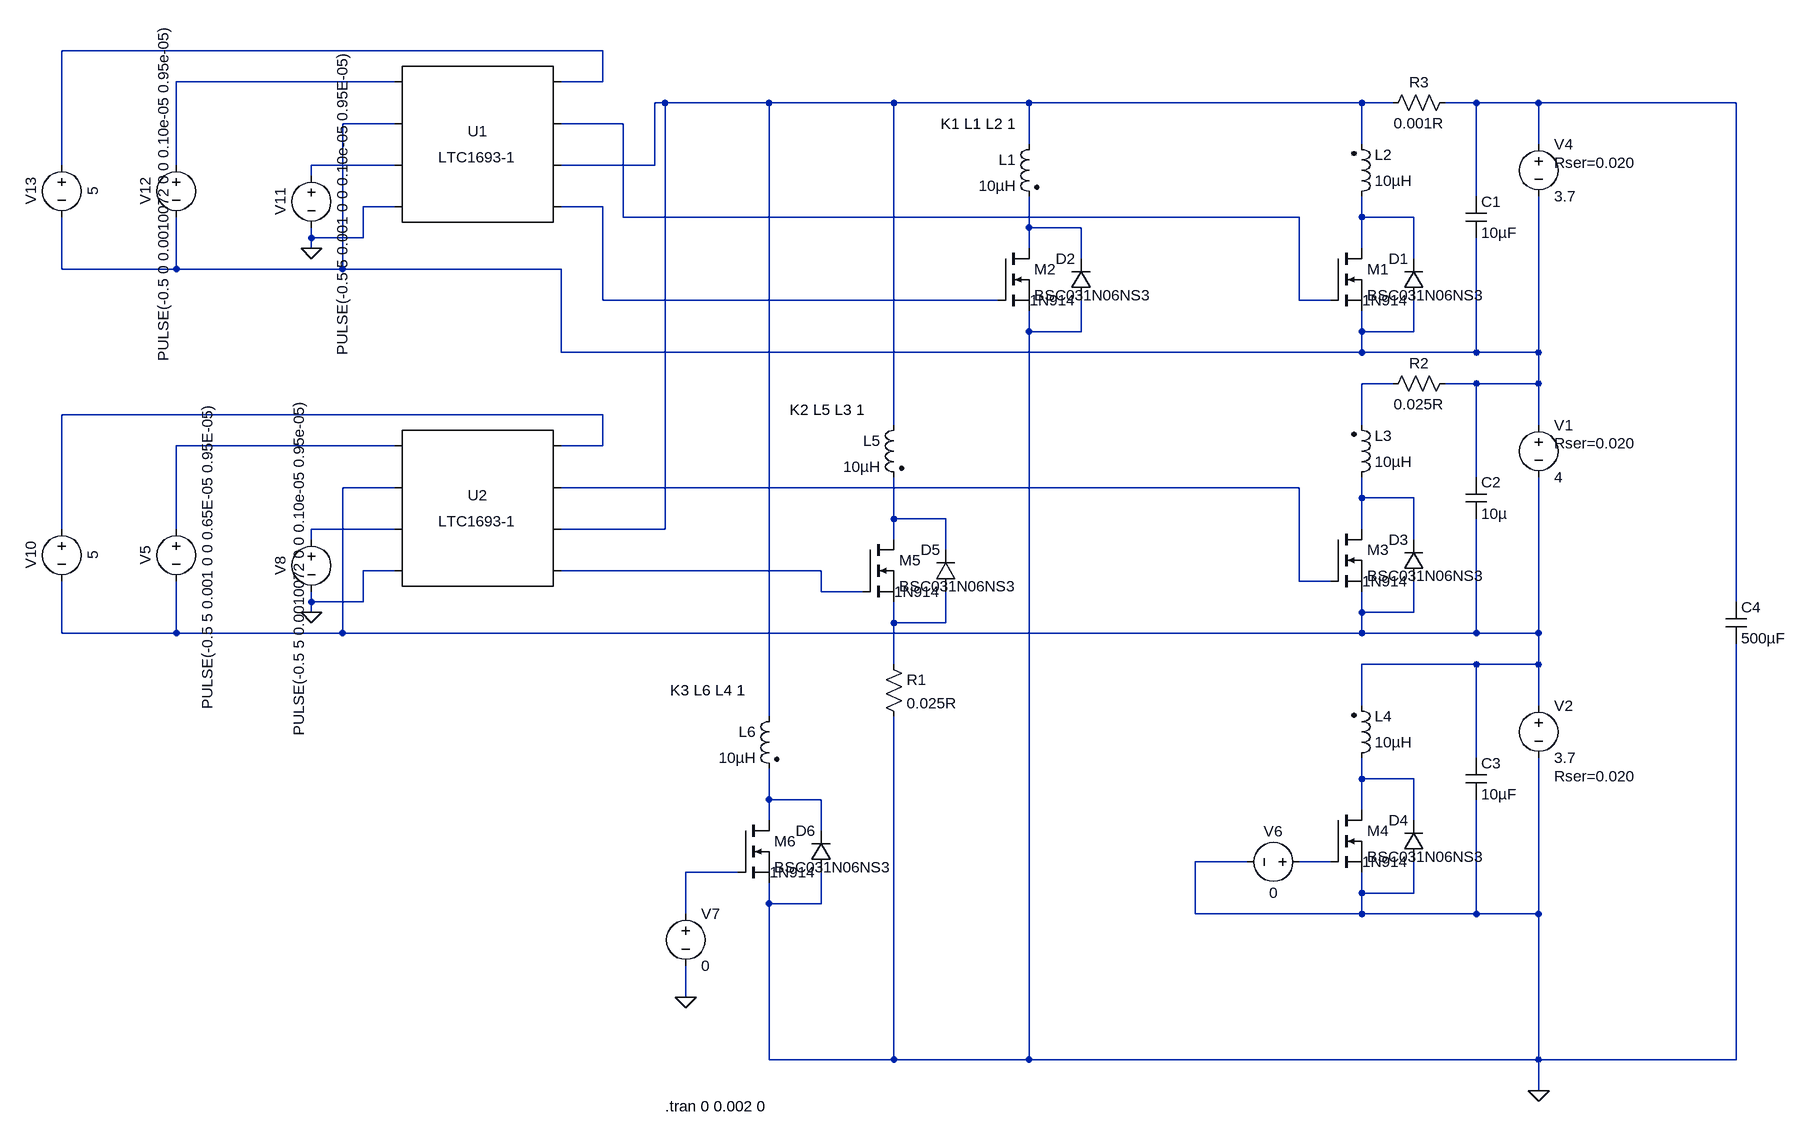
[diagram p0: schematic bms_action.asc]
bms_action.asc, the LTspice schematic file:
Version 4
SHEET 1 1480 888
WIRE -1024 -752 -1856 -752
WIRE -1344 -704 -1680 -704
WIRE -1024 -704 -1024 -752
WIRE -1024 -704 -1088 -704
WIRE -928 -672 -944 -672
WIRE -768 -672 -928 -672
WIRE -576 -672 -768 -672
WIRE -368 -672 -576 -672
WIRE 144 -672 -368 -672
WIRE 192 -672 144 -672
WIRE 320 -672 272 -672
WIRE 416 -672 320 -672
WIRE 720 -672 416 -672
WIRE -1344 -640 -1424 -640
WIRE -992 -640 -1088 -640
WIRE -368 -608 -368 -672
WIRE 144 -608 144 -672
WIRE 416 -608 416 -672
WIRE -1856 -576 -1856 -752
WIRE -1680 -576 -1680 -704
WIRE -1344 -576 -1472 -576
WIRE -944 -576 -944 -672
WIRE -944 -576 -1088 -576
WIRE -1472 -560 -1472 -576
WIRE 320 -528 320 -672
WIRE -1344 -512 -1392 -512
WIRE -1024 -512 -1088 -512
WIRE -992 -496 -992 -640
WIRE 48 -496 -992 -496
WIRE 144 -496 144 -528
WIRE 224 -496 144 -496
WIRE -368 -480 -368 -528
WIRE -288 -480 -368 -480
WIRE -1472 -464 -1472 -480
WIRE -1392 -464 -1392 -512
WIRE -1392 -464 -1472 -464
WIRE -1472 -448 -1472 -464
WIRE -368 -448 -368 -480
WIRE 144 -448 144 -496
WIRE -288 -432 -288 -480
WIRE 224 -432 224 -496
WIRE -1856 -416 -1856 -496
WIRE -1680 -416 -1680 -496
WIRE -1680 -416 -1856 -416
WIRE -1424 -416 -1424 -640
WIRE -1424 -416 -1680 -416
WIRE -1088 -416 -1424 -416
WIRE -1024 -368 -1024 -512
WIRE -416 -368 -1024 -368
WIRE 48 -368 48 -496
WIRE 96 -368 48 -368
WIRE -368 -320 -368 -352
WIRE -288 -320 -288 -368
WIRE -288 -320 -368 -320
WIRE 144 -320 144 -352
WIRE 224 -320 224 -368
WIRE 224 -320 144 -320
WIRE -1088 -288 -1088 -416
WIRE 144 -288 144 -320
WIRE 144 -288 -1088 -288
WIRE 320 -288 320 -464
WIRE 320 -288 144 -288
WIRE 416 -288 416 -528
WIRE 416 -288 320 -288
WIRE 192 -240 144 -240
WIRE 320 -240 272 -240
WIRE 416 -240 416 -288
WIRE 416 -240 320 -240
WIRE -1024 -192 -1856 -192
WIRE -576 -176 -576 -672
WIRE 144 -176 144 -240
WIRE 416 -176 416 -240
WIRE -1344 -144 -1680 -144
WIRE -1024 -144 -1024 -192
WIRE -1024 -144 -1088 -144
WIRE 320 -96 320 -240
WIRE -1344 -80 -1424 -80
WIRE 48 -80 -1088 -80
WIRE 144 -64 144 -96
WIRE 224 -64 144 -64
WIRE -576 -32 -576 -96
WIRE -496 -32 -576 -32
WIRE -1856 -16 -1856 -192
WIRE -1680 -16 -1680 -144
WIRE -1344 -16 -1472 -16
WIRE -928 -16 -928 -672
WIRE -928 -16 -1088 -16
WIRE 144 -16 144 -64
WIRE -1472 0 -1472 -16
WIRE -576 0 -576 -32
WIRE 224 0 224 -64
WIRE -496 16 -496 -32
WIRE -1344 48 -1392 48
WIRE -688 48 -1088 48
WIRE 48 64 48 -80
WIRE 96 64 48 64
WIRE -688 80 -688 48
WIRE -624 80 -688 80
WIRE -1472 96 -1472 80
WIRE -1392 96 -1392 48
WIRE -1392 96 -1472 96
WIRE 720 96 720 -672
WIRE -1472 112 -1472 96
WIRE 144 112 144 80
WIRE 224 112 224 64
WIRE 224 112 144 112
WIRE -576 128 -576 96
WIRE -496 128 -496 80
WIRE -496 128 -576 128
WIRE -1856 144 -1856 64
WIRE -1680 144 -1680 64
WIRE -1680 144 -1856 144
WIRE -1424 144 -1424 -80
WIRE -1424 144 -1680 144
WIRE 144 144 144 112
WIRE 144 144 -1424 144
WIRE 320 144 320 -32
WIRE 320 144 144 144
WIRE 416 144 416 -96
WIRE 416 144 320 144
WIRE -576 192 -576 128
WIRE 320 192 144 192
WIRE 416 192 416 144
WIRE 416 192 320 192
WIRE 144 256 144 192
WIRE 416 256 416 192
WIRE -768 272 -768 -672
WIRE 320 336 320 192
WIRE 144 368 144 336
WIRE 224 368 144 368
WIRE -768 400 -768 352
WIRE -688 400 -768 400
WIRE 144 416 144 368
WIRE -768 432 -768 400
WIRE 224 432 224 368
WIRE -688 448 -688 400
WIRE -32 496 -112 496
WIRE 96 496 48 496
WIRE -816 512 -896 512
WIRE 144 544 144 512
WIRE 224 544 224 496
WIRE 224 544 144 544
WIRE -768 560 -768 528
WIRE -688 560 -688 512
WIRE -688 560 -768 560
WIRE -896 576 -896 512
WIRE -112 576 -112 496
WIRE 144 576 144 544
WIRE 144 576 -112 576
WIRE 320 576 320 400
WIRE 320 576 144 576
WIRE 416 576 416 336
WIRE 416 576 320 576
WIRE -896 704 -896 656
WIRE -768 800 -768 560
WIRE -576 800 -576 272
WIRE -576 800 -768 800
WIRE -368 800 -368 -320
WIRE -368 800 -576 800
WIRE 416 800 416 576
WIRE 416 800 -368 800
WIRE 720 800 720 160
WIRE 720 800 416 800
WIRE 416 848 416 800
FLAG 416 848 0
FLAG -896 704 0
FLAG -1472 112 0
FLAG -1472 -448 0
SYMBOL voltage 416 -624 R0
WINDOW 123 0 0 Left 2
WINDOW 39 24 44 Left 2
SYMATTR SpiceLine Rser=0.020
SYMATTR InstName V4
SYMATTR Value 3.7
SYMBOL ind2 -352 -624 M0
SYMATTR InstName L1
SYMATTR Value 10µH
SYMATTR Type ind
SYMBOL ind2 128 -512 M180
WINDOW 0 36 80 Left 2
WINDOW 3 36 40 Left 2
SYMATTR InstName L2
SYMATTR Value 10µH
SYMATTR Type ind
SYMBOL nmos 96 -448 R0
SYMATTR InstName M1
SYMATTR Value BSC031N06NS3
SYMBOL diode 240 -368 R180
WINDOW 0 24 64 Left 2
WINDOW 3 24 0 Left 2
SYMATTR InstName D1
SYMATTR Value 1N914
SYMATTR Description Schottky diode
SYMATTR Type schottky
SYMBOL nmos -416 -448 R0
SYMATTR InstName M2
SYMATTR Value BSC031N06NS3
SYMBOL diode -272 -368 R180
WINDOW 0 24 64 Left 2
WINDOW 3 24 0 Left 2
SYMATTR InstName D2
SYMATTR Value 1N914
SYMATTR Description Schottky diode
SYMATTR Type schottky
SYMBOL voltage 416 -192 R0
WINDOW 123 0 0 Left 2
WINDOW 39 24 44 Left 2
SYMATTR SpiceLine Rser=0.020
SYMATTR InstName V1
SYMATTR Value 4
SYMBOL ind2 128 -80 M180
WINDOW 0 36 80 Left 2
WINDOW 3 36 40 Left 2
SYMATTR InstName L3
SYMATTR Value 10µH
SYMATTR Type ind
SYMBOL nmos 96 -16 R0
SYMATTR InstName M3
SYMATTR Value BSC031N06NS3
SYMBOL diode 240 64 R180
WINDOW 0 24 64 Left 2
WINDOW 3 24 0 Left 2
SYMATTR InstName D3
SYMATTR Value 1N914
SYMATTR Description Schottky diode
SYMATTR Type schottky
SYMBOL voltage 416 240 R0
WINDOW 123 0 0 Left 2
WINDOW 39 24 124 Left 2
SYMATTR SpiceLine Rser=0.020
SYMATTR InstName V2
SYMATTR Value 3.7
SYMBOL ind2 128 352 M180
WINDOW 0 36 80 Left 2
WINDOW 3 36 40 Left 2
SYMATTR InstName L4
SYMATTR Value 10µH
SYMATTR Type ind
SYMBOL nmos 96 416 R0
SYMATTR InstName M4
SYMATTR Value BSC031N06NS3
SYMBOL diode 240 496 R180
WINDOW 0 24 64 Left 2
WINDOW 3 24 0 Left 2
SYMATTR InstName D4
SYMATTR Value 1N914
SYMATTR Description Schottky diode
SYMATTR Type schottky
SYMBOL ind2 -560 -192 M0
SYMATTR InstName L5
SYMATTR Value 10µH
SYMATTR Type ind
SYMBOL nmos -624 0 R0
SYMATTR InstName M5
SYMATTR Value BSC031N06NS3
SYMBOL diode -480 80 R180
WINDOW 0 24 64 Left 2
WINDOW 3 24 0 Left 2
SYMATTR InstName D5
SYMATTR Value 1N914
SYMATTR Description Schottky diode
SYMATTR Type schottky
SYMBOL ind2 -752 256 M0
SYMATTR InstName L6
SYMATTR Value 10µH
SYMATTR Type ind
SYMBOL nmos -816 432 R0
SYMATTR InstName M6
SYMATTR Value BSC031N06NS3
SYMBOL diode -672 512 R180
WINDOW 0 24 64 Left 2
WINDOW 3 24 0 Left 2
SYMATTR InstName D6
SYMATTR Value 1N914
SYMATTR Description Schottky diode
SYMATTR Type schottky
SYMBOL cap 304 -528 R0
SYMATTR InstName C1
SYMATTR Value 10µF
SYMBOL cap 304 -96 R0
SYMATTR InstName C2
SYMATTR Value 10µ
SYMATTR SpiceLine V=6.3 Irms=11.832 Rser=0.003 Lser=0
SYMBOL cap 304 336 R0
SYMATTR InstName C3
SYMATTR Value 10µF
SYMBOL voltage -896 560 R0
WINDOW 123 0 0 Left 2
WINDOW 39 0 0 Left 2
SYMATTR InstName V7
SYMATTR Value 0
SYMBOL voltage -1680 -32 R0
WINDOW 0 -32 56 VBottom 2
WINDOW 3 32 56 VTop 2
WINDOW 123 0 0 Left 2
WINDOW 39 0 0 Left 2
SYMATTR InstName V5
SYMATTR Value PULSE(-0.5 5 0.001 0 0 0.65E-05 0.95E-05)
SYMBOL voltage 64 496 R90
WINDOW 0 -32 56 VBottom 2
WINDOW 3 32 56 VTop 2
WINDOW 123 0 0 Left 2
WINDOW 39 0 0 Left 2
SYMATTR InstName V6
SYMATTR Value 0
SYMBOL voltage -1472 -16 R0
WINDOW 0 -32 56 VBottom 2
WINDOW 3 -4 56 VBottom 2
WINDOW 123 0 0 Left 2
WINDOW 39 0 0 Left 2
SYMATTR InstName V8
SYMATTR Value PULSE(-0.5 5 0.0010072 0 0 0.10e-05 0.95e-05)
SYMBOL res -592 176 R0
SYMATTR InstName R1
SYMATTR Value 0.025R
SYMBOL res 288 -256 R90
WINDOW 0 0 56 VBottom 2
WINDOW 3 32 56 VTop 2
SYMATTR InstName R2
SYMATTR Value 0.025R
SYMBOL cap 704 96 R0
SYMATTR InstName C4
SYMATTR Value 500µF
SYMBOL PowerProducts\\LTC1693-1 -1216 -48 R0
SYMATTR InstName U2
SYMBOL voltage -1856 -32 R0
WINDOW 0 -32 56 VBottom 2
WINDOW 3 32 56 VTop 2
WINDOW 123 0 0 Left 2
WINDOW 39 0 0 Left 2
SYMATTR InstName V10
SYMATTR Value 5
SYMBOL voltage -1472 -576 R0
WINDOW 0 -32 56 VBottom 2
WINDOW 3 32 56 VTop 2
WINDOW 123 0 0 Left 2
WINDOW 39 0 0 Left 2
SYMATTR InstName V11
SYMATTR Value PULSE(-0.5 5 0.001 0 0 0.10e-05 0.95E-05)
SYMBOL voltage -1680 -592 R0
WINDOW 0 -32 56 VBottom 2
WINDOW 3 -4 56 VBottom 2
WINDOW 123 0 0 Left 2
WINDOW 39 0 0 Left 2
SYMATTR InstName V12
SYMATTR Value PULSE(-0.5 0 0.0010072 0 0 0.10e-05 0.95e-05)
SYMBOL PowerProducts\\LTC1693-1 -1216 -608 R0
SYMATTR InstName U1
SYMBOL voltage -1856 -592 R0
WINDOW 0 -32 56 VBottom 2
WINDOW 3 32 56 VTop 2
WINDOW 123 0 0 Left 2
WINDOW 39 0 0 Left 2
SYMATTR InstName V13
SYMATTR Value 5
SYMBOL res 288 -688 R90
WINDOW 0 0 56 VBottom 2
WINDOW 3 32 56 VTop 2
SYMATTR InstName R3
SYMATTR Value 0.001R
TEXT -504 -640 Left 2 !K1 L1 L2 1
TEXT -736 -200 Left 2 !K2 L5 L3 1
TEXT -920 232 Left 2 !K3 L6 L4 1
TEXT -928 872 Left 2 !.tran 0 0.002 0

The netlist it stands for:
* bms_action.asc
V4 N004 N005 3.7 Rser=0.020
L1 N003 N010 10µH
L2 N009 N003 10µH
M1 N009 N006 N005 N005 BSC031N06NS3
D1 N005 N009 1N914
M2 N010 N008 0 0 BSC031N06NS3
D2 0 N010 1N914
V1 N005 N014 4 Rser=0.020
L3 N016 N011 10µH
M3 N016 N015 N014 N014 BSC031N06NS3
D3 N014 N016 1N914
V2 N014 0 3.7 Rser=0.020
L4 N021 N014 10µH
M4 N021 N023 0 0 BSC031N06NS3
D4 0 N021 1N914
L5 N003 N017 10µH
M5 N017 N019 N020 N020 BSC031N06NS3
D5 N020 N017 1N914
L6 N003 N022 10µH
M6 N022 N024 0 0 BSC031N06NS3
D6 0 N022 1N914
C1 N004 N005 10µF
C2 N005 N014 10µ V=6.3 Irms=11.832 Rser=0.003 Lser=0
C3 N014 0 10µF
V7 N024 0 0
V5 N013 N014 PULSE(-0.5 5 0.001 0 0 0.65E-05 0.95E-05)
V6 N023 0 0
V8 N018 0 PULSE(-0.5 5 0.0010072 0 0 0.10e-05 0.95e-05)
R1 N020 0 0.025R
R2 N005 N011 0.025R
C4 N004 0 500µF
XU2 N013 N014 N018 0 N019 N003 N015 N012 LTC1693-1
V10 N012 N014 5
V11 N007 0 PULSE(-0.5 5 0.001 0 0 0.10e-05 0.95E-05)
V12 N002 N005 PULSE(-0.5 0 0.0010072 0 0 0.10e-05 0.95e-05)
XU1 N002 N005 N007 0 N008 N003 N006 N001 LTC1693-1
V13 N001 N005 5
R3 N004 N003 0.001R
.model D D
.lib standard.dio
.model NMOS NMOS
.model PMOS PMOS
.lib standard.mos
K1 L1 L2 1
K2 L5 L3 1
K3 L6 L4 1
.tran 0 0.002 0
.lib LTC1693-1.sub
.backanno
.end